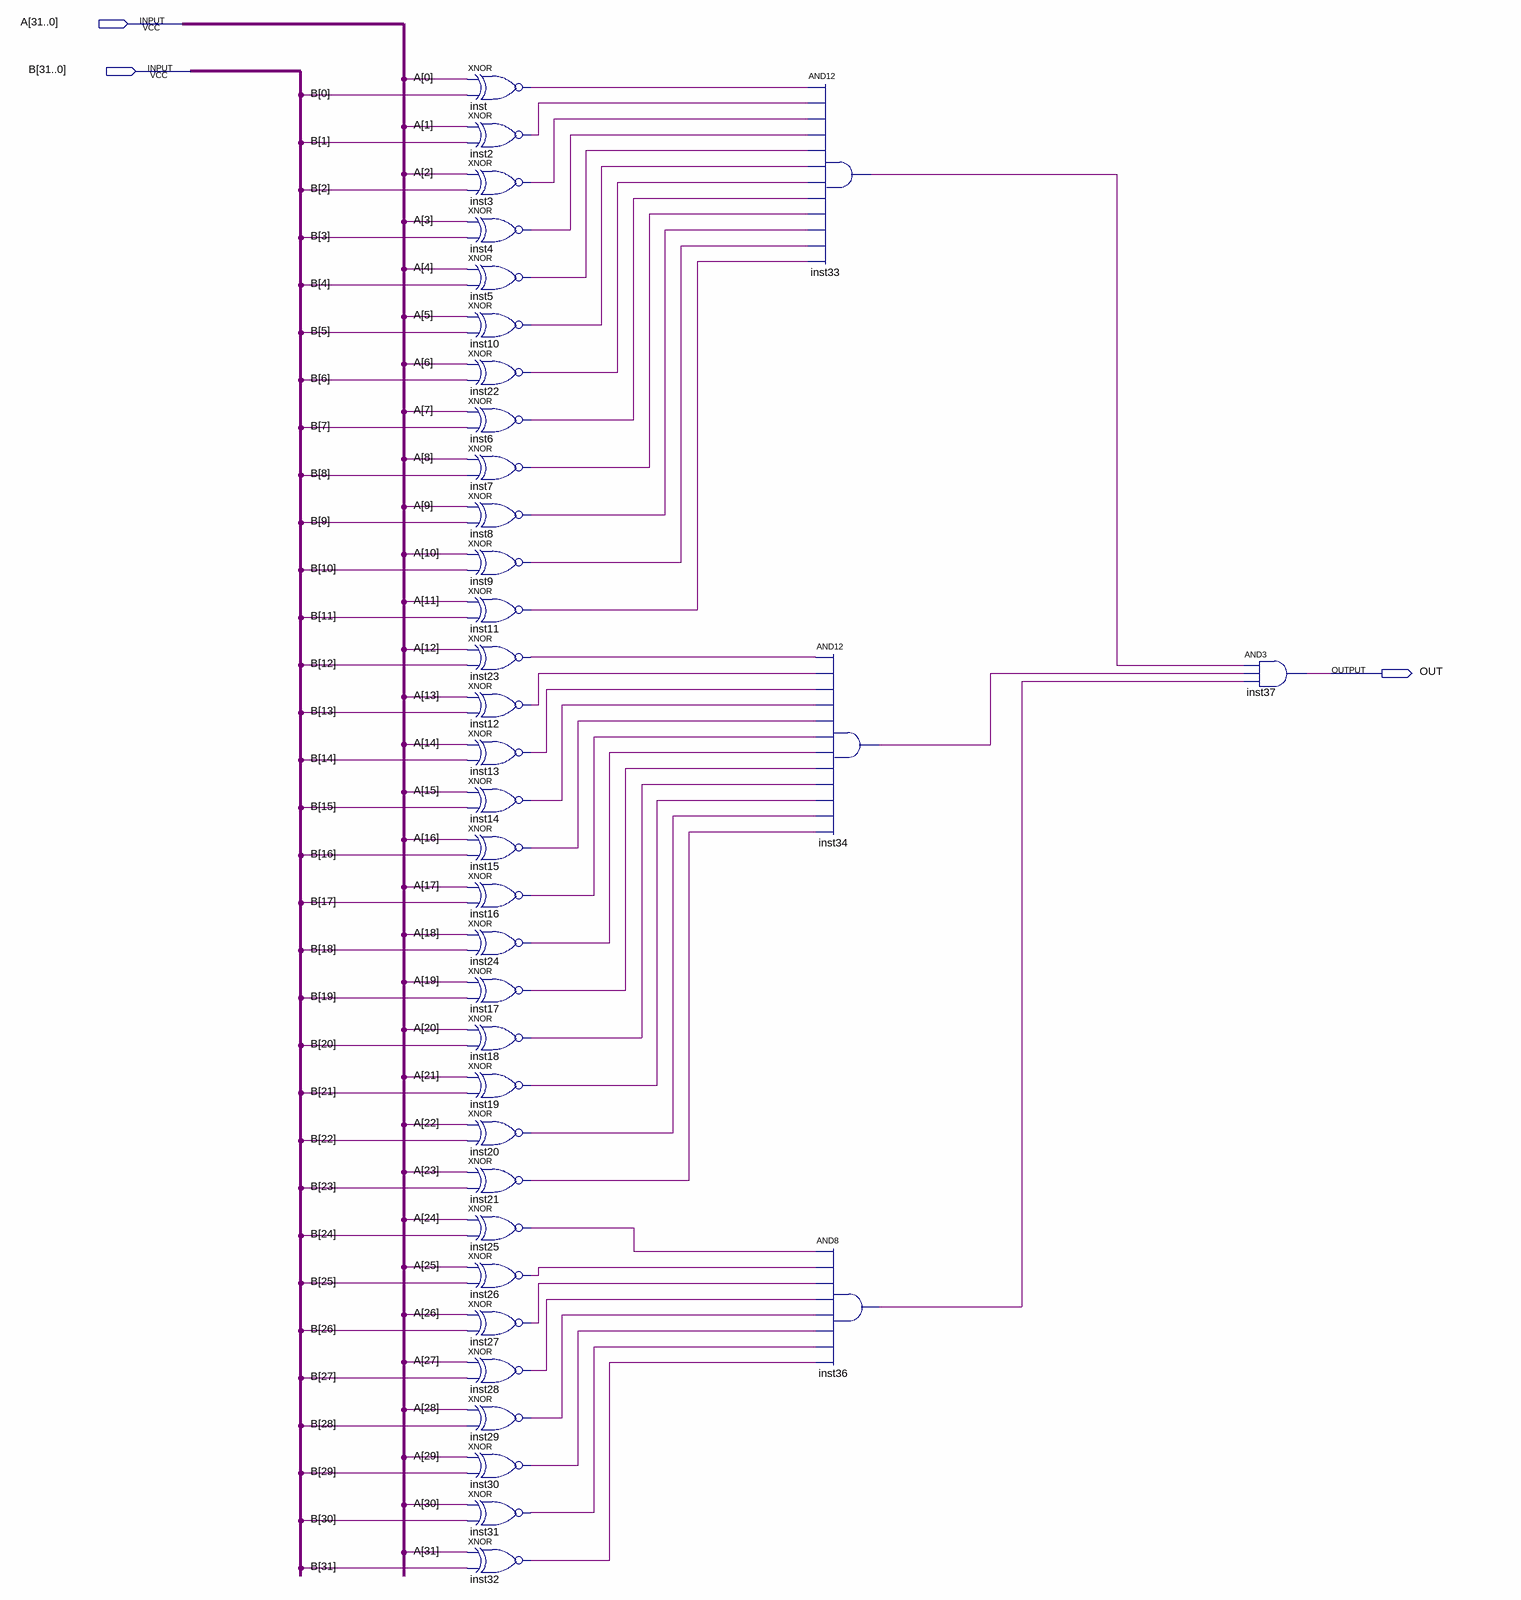
[diagram p0: schematic sheet]
// Quartus schematic COMPARADOR32bits.bdf as structural Verilog: 36 symbols, 3 pins
module COMPARADOR32bits (
  input  [31:0] A,
  input  [31:0] B,
  output OUT
);

  wire inst2_out, inst3_out, inst4_out, inst5_out, inst6_out, inst7_out, inst8_out, inst9_out, inst10_out,
       inst11_out, inst12_out, inst13_out, inst14_out, inst15_out, inst16_out, inst17_out, inst18_out,
       inst19_out, inst20_out, inst21_out, inst22_out, inst23_out, inst24_out, inst25_out, inst26_out,
       inst27_out, inst28_out, inst29_out, inst30_out, inst31_out, inst32_out, inst33_out, inst34_out,
       inst36_out, inst_out;

  xnor inst (inst_out, A[0], B[0]);
  xnor inst2 (inst2_out, A[1], B[1]);
  xnor inst3 (inst3_out, A[2], B[2]);
  xnor inst4 (inst4_out, A[3], B[3]);
  xnor inst5 (inst5_out, A[4], B[4]);
  xnor inst10 (inst10_out, A[5], B[5]);
  xnor inst22 (inst22_out, A[6], B[6]);
  xnor inst6 (inst6_out, A[7], B[7]);
  xnor inst7 (inst7_out, A[8], B[8]);
  xnor inst8 (inst8_out, A[9], B[9]);
  xnor inst9 (inst9_out, A[10], B[10]);
  xnor inst11 (inst11_out, A[11], B[11]);
  xnor inst23 (inst23_out, A[12], B[12]);
  xnor inst12 (inst12_out, A[13], B[13]);
  xnor inst13 (inst13_out, A[14], B[14]);
  xnor inst14 (inst14_out, A[15], B[15]);
  xnor inst15 (inst15_out, A[16], B[16]);
  xnor inst16 (inst16_out, A[17], B[17]);
  xnor inst24 (inst24_out, A[18], B[18]);
  xnor inst17 (inst17_out, A[19], B[19]);
  xnor inst18 (inst18_out, A[20], B[20]);
  xnor inst19 (inst19_out, A[21], B[21]);
  xnor inst20 (inst20_out, A[22], B[22]);
  xnor inst21 (inst21_out, A[23], B[23]);
  xnor inst25 (inst25_out, A[24], B[24]);
  xnor inst26 (inst26_out, A[25], B[25]);
  xnor inst27 (inst27_out, A[26], B[26]);
  xnor inst28 (inst28_out, A[27], B[27]);
  xnor inst29 (inst29_out, A[28], B[28]);
  xnor inst30 (inst30_out, A[29], B[29]);
  xnor inst31 (inst31_out, A[30], B[30]);
  xnor inst32 (inst32_out, A[31], B[31]);
  and inst33 (inst33_out, inst_out, inst2_out, inst3_out, inst4_out, inst5_out, inst10_out, inst22_out, inst6_out, inst7_out, inst8_out, inst9_out, inst11_out);
  and inst34 (inst34_out, inst23_out, inst12_out, inst13_out, inst14_out, inst15_out, inst16_out, inst24_out, inst17_out, inst18_out, inst19_out, inst20_out, inst21_out);
  and inst36 (inst36_out, inst25_out, inst26_out, inst27_out, inst28_out, inst29_out, inst30_out, inst31_out, inst32_out);
  and inst37 (OUT, inst33_out, inst34_out, inst36_out);
endmodule
